# Altium schematic sheet Power_InrushLimit.SchDoc: Inrush Current Limiter
size Letter; Engineer: Nathan Petersen; DocumentNumber: 5; SheetNumber: 5; SheetTotal: 23
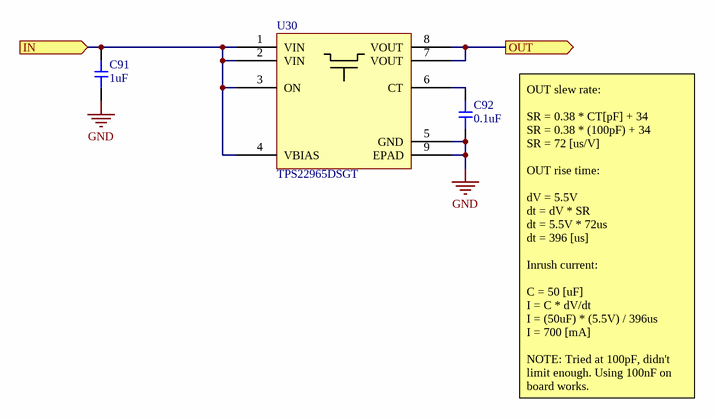
[diagram p0: Power_InrushLimit.SchDoc]

## Parts
C91  value 1uF  [0603-CAP]  (hidden comment: Capacitor)
C92  value 0.1uF  [0603-CAP]  (hidden comment: Capacitor)
U30  TPS22965DSGT  [SON50P200X80_HS-9N]

## Ports
IN (in), OUT (out)

## Nets
GND: C91.1 C92.1 U30.5(GND) U30.9(EPAD)
IN: C91.2 U30.1(VIN) U30.2(VIN) U30.3(ON) U30.4(VBIAS) ; port IN
OUT: U30.7(VOUT) U30.8(VOUT) ; port OUT
NetC92_2: C92.2 U30.6(CT)

## Notes on the sheet
- OUT slew rate:
  SR = 0.38 * CT[pF] + 34
  SR = 0.38 * (100pF) + 34
  SR = 72 [us/V]
  OUT rise time:
  dV = 5.5V
  dt = dV * SR
  dt = 5.5V * 72us
  dt = 396 [us]
  Inrush current:
  C = 50 [uF]
  I = C * dV/dt
  I = (50uF) * (5.5V) / 396us
  I = 700 [mA]
  NOTE: Tried at 100pF, didn't limit enough. Using 100nF on board works.
- Title:
- File:
- Sheet:
- of
- Revision:
- Time:
- Date:
- Engineer:

## Library data of the parts
U30 = TPS22965DSGT: IC LOAD SWITCH 6A 8WSON; Supplier 1: Digi-Key; Supplier Part Number 1: 296-34943-1-ND
C91 C92 = Capacitor: Supplier 1: Digi-Key
  C91: Supplier Part Number 1: 1276-6524-6-ND
  C92: Supplier Part Number 1: 1276-1012-6-ND